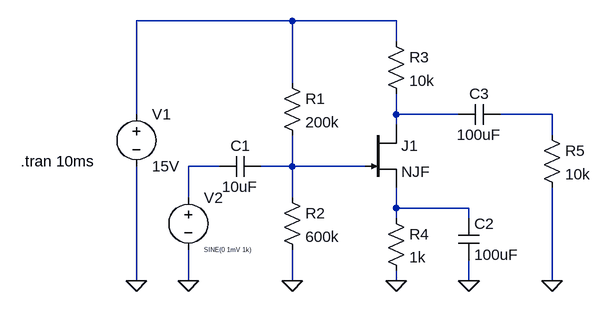
[diagram p0: schematic jfet-amplifier-source-common.asc]
jfet-amplifier-source-common.asc, the LTspice schematic file:
Version 4
SHEET 1 880 680
WIRE 64 -16 -176 -16
WIRE 224 -16 64 -16
WIRE 224 16 224 -16
WIRE 64 80 64 -16
WIRE -176 128 -176 -16
WIRE 224 128 224 96
WIRE 320 128 224 128
WIRE 464 128 384 128
WIRE 224 144 224 128
WIRE 464 160 464 128
WIRE -48 208 -96 208
WIRE 64 208 64 160
WIRE 64 208 16 208
WIRE 176 208 64 208
WIRE -96 256 -96 208
WIRE 64 256 64 208
WIRE 224 272 224 240
WIRE 336 272 224 272
WIRE 224 288 224 272
WIRE 336 288 336 272
WIRE -176 384 -176 208
WIRE -96 384 -96 336
WIRE 64 384 64 336
WIRE 224 384 224 368
WIRE 336 384 336 352
WIRE 464 384 464 240
FLAG -176 384 0
FLAG -96 384 0
FLAG 64 384 0
FLAG 224 384 0
FLAG 336 384 0
FLAG 464 384 0
SYMBOL voltage -176 112 R0
WINDOW 123 0 0 Left 0
WINDOW 39 0 0 Left 0
SYMATTR InstName V1
SYMATTR Value 15V
SYMBOL res 48 64 R0
SYMATTR InstName R1
SYMATTR Value 200k
SYMBOL res 48 240 R0
SYMATTR InstName R2
SYMATTR Value 600k
SYMBOL res 208 0 R0
SYMATTR InstName R3
SYMATTR Value 10k
SYMBOL res 208 272 R0
SYMATTR InstName R4
SYMATTR Value 1k
SYMBOL res 448 144 R0
SYMATTR InstName R5
SYMATTR Value 10k
SYMBOL cap 16 192 R90
WINDOW 0 0 32 VBottom 2
WINDOW 3 32 32 VTop 2
SYMATTR InstName C1
SYMATTR Value 10uF
SYMBOL cap 320 288 R0
SYMATTR InstName C2
SYMATTR Value 100uF
SYMBOL cap 384 112 R90
WINDOW 0 0 32 VBottom 2
WINDOW 3 32 32 VTop 2
SYMATTR InstName C3
SYMATTR Value 100uF
SYMBOL voltage -96 240 R0
WINDOW 3 24 96 Left 0
WINDOW 123 0 0 Left 0
WINDOW 39 0 0 Left 0
SYMATTR InstName V2
SYMATTR Value SINE(0 1mV 1k)
SYMBOL njf 176 144 R0
SYMATTR InstName J1
TEXT -354 200 Left 2 !.tran 10ms

The netlist it stands for:
* jfet-amplifier-source-common.asc
V1 N001 0 15V
R1 N001 N005 200k
R2 N005 0 600k
R3 N001 N002 10k
R4 N006 0 1k
R5 N003 0 10k
C1 N005 N004 10uF
C2 N006 0 100uF
C3 N003 N002 100uF
V2 N004 0 SINE(0 1mV 1k)
J1 N002 N005 N006 NJF
.model NJF NJF
.model PJF PJF
.lib standard.jft
.tran 10ms
.backanno
.end